# EAGLE design Brain_0.1.rv1 (EAGLE 9.6.2)
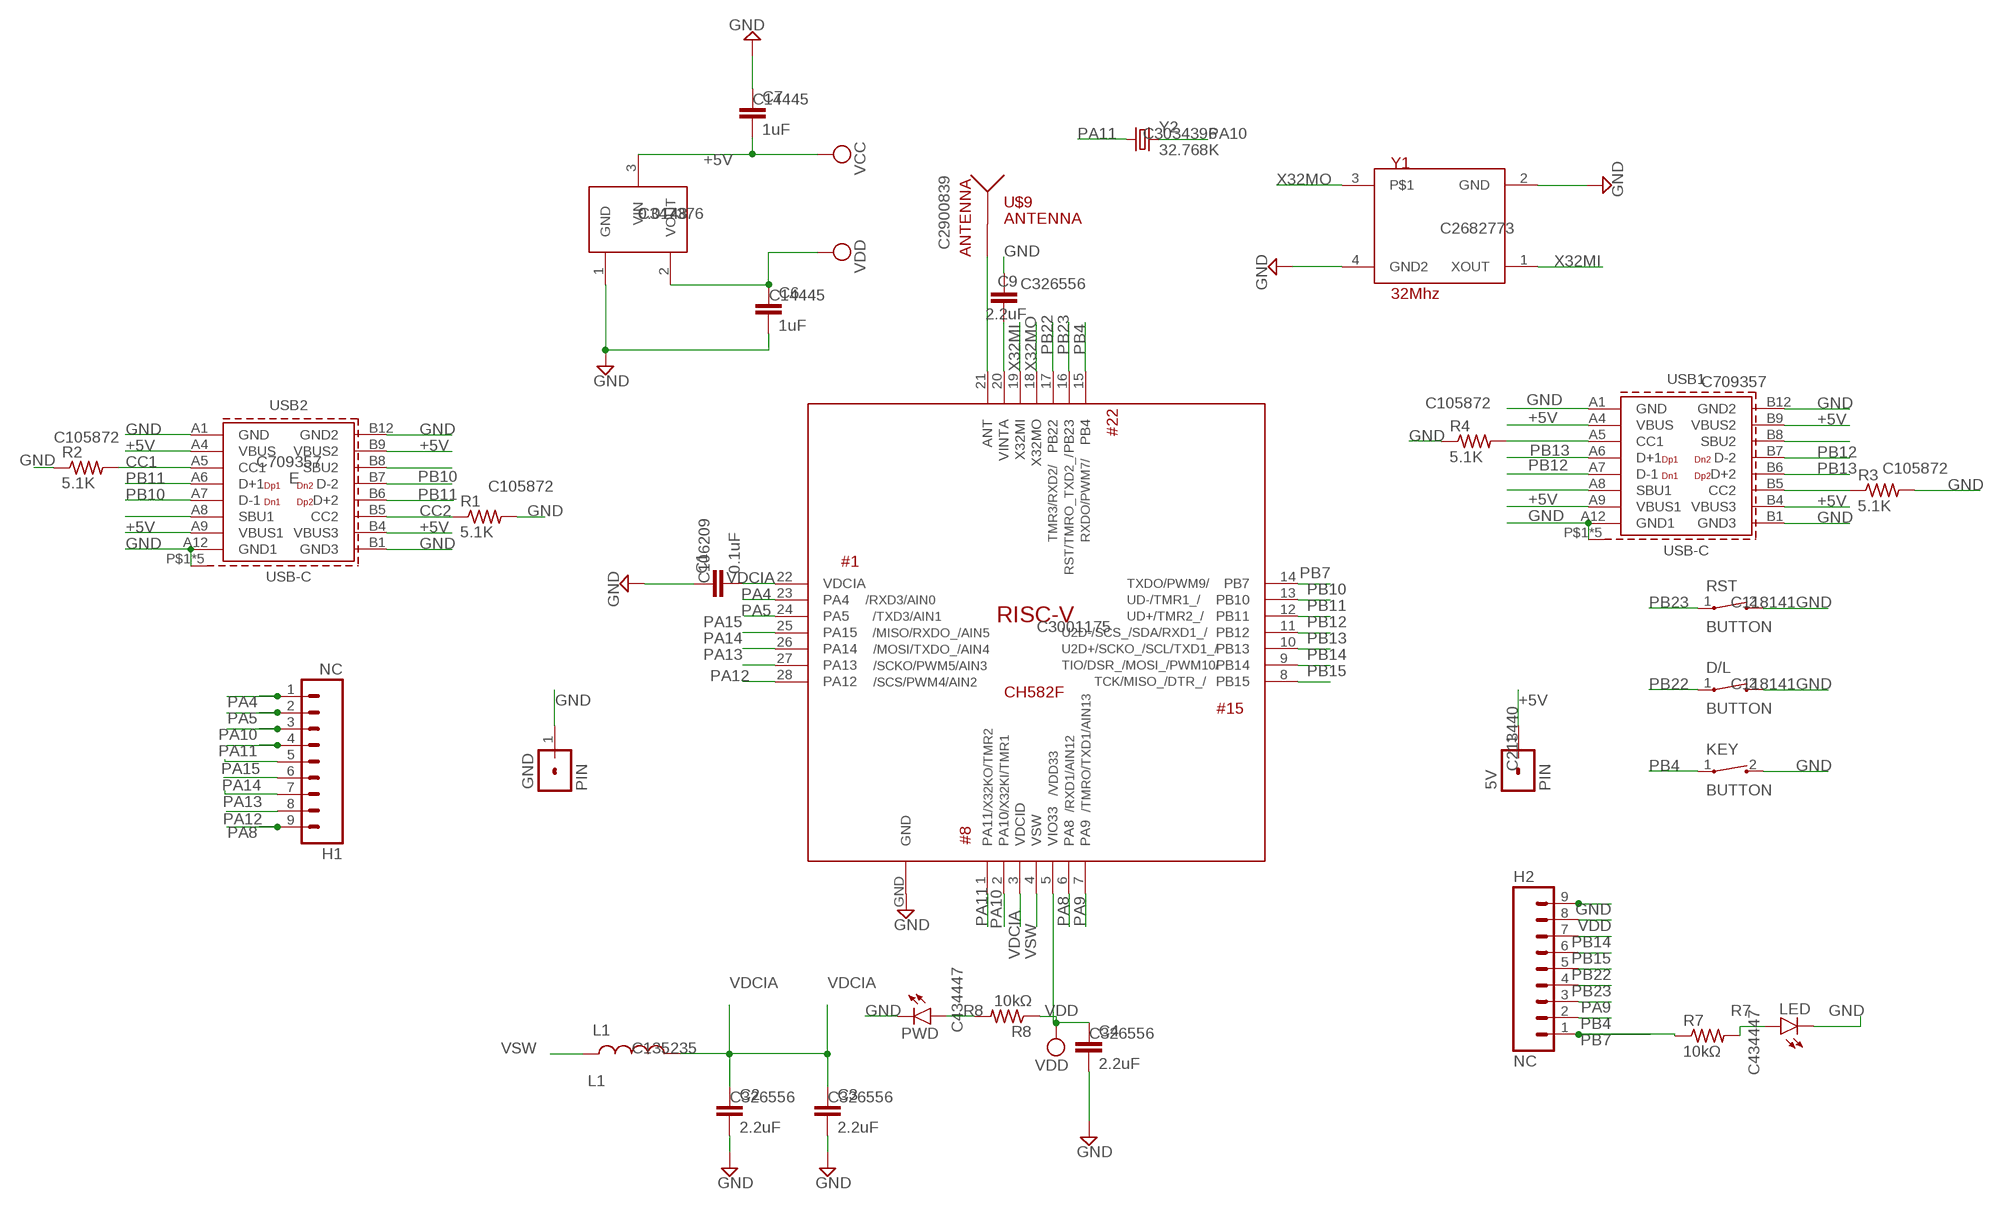
[diagram p0: schematic, sheet 1]

## Parts
5V  PIN  [1X01]
C1  0.1uF  C  [C1]
C2  2.2uF  C  [C1]
C3  2.2uF  C  [C1]
C4  2.2uF  C  [C1]
C6  1uF  C  [C1]
C7  1uF  C  [C1]
C9  2.2uF  C  [C1]
D/L  BUTTON  [SOD8037X250N]
GND  PIN  [1X01]
H1  NC  H  [61300911821]
H2  NC  H  [61300911821]
KEY  BUTTON  [SOD8037X250N]
L1  L1  [RESC3025X120N]
LED  LED  [CAPCP1005X40N]
PWD  LED  [CAPCP1005X40N]
R1  5.1K  RR0402  [R0402]
R2  5.1K  RR0402  [R0402]
R3  5.1K  RR0402  [R0402]
R4  5.1K  RR0402  [R0402]
R7  10kΩ  RR0402  [R0402]
R8  10kΩ  RR0402  [R0402]
RST  BUTTON  [SOD8037X250N]
U1  U1  [SOT95P240X90-3N]
U$8  RISC-V  [QFN40P400X400X75-29T280N]
U$9  ANTENNA  [CAPCP3015X50N]
USB1  629722000214  J1  [629722000214]
USB2  629722000214  J1  [629722000214]
Y1  Y1YSX211SL  [OSCCC200X160X50N]
Y2  32.768K  Y2  [XTAL700X315X230N]

## Nets
+5V: 5V.1 C7.2 U1.3(VIN) USB1.A4(VBUS) USB1.A9(VBUS1) USB1.B4(VBUS3) USB1.B9(VBUS2) USB2.A4(VBUS) USB2.A9(VBUS1) USB2.B4(VBUS3) USB2.B9(VBUS2) ; supply symbol labelled VCC
CC1: R2.2 USB2.A5(CC1)
CC2: R1.1 USB2.B5(CC2)
GND: C1.1 C2.2 C3.2 C4.2 C6.2 C7.1 C9.1 D/L.2 GND.1 H2.9 KEY.2 LED.C PWD.C R1.2 R2.1 R3.2 R4.1 RST.2 U1.1(GND) U$8.GND USB1.A1(GND) USB1.A12(GND1) USB1.B1(GND3) USB1.B12(GND2) USB1.P$1(SHIELD) USB1.S1(SHIELD) USB1.S2(SHIELD) USB1.S3(SHIELD) USB1.S4(SHIELD) USB2.A1(GND) USB2.A12(GND1) USB2.B1(GND3) USB2.B12(GND2) USB2.P$1(SHIELD) USB2.S1(SHIELD) USB2.S2(SHIELD) USB2.S3(SHIELD) USB2.S4(SHIELD) Y1.2(GND) Y1.4(GND2)
N$1: U$8.21(ANT) U$9.1
N$2: C9.2 U$8.20(VINTA)
N$3: USB1.B8(SBU2)
N$4: R3.1 USB1.B5(CC2)
N$6: USB2.A8(SBU1)
N$11: USB2.B8(SBU2)
N$13: R4.2 USB1.A5(CC1)
N$16: USB1.A8(SBU1)
PA4: H1.1 U$8.23(PA4)
PA5: H1.2 U$8.24(PA5)
PA8: H1.9 U$8.6(PA8)
PA9: H2.3 U$8.7(PA9)
PA10: H1.3 U$8.2(PA10) Y2.2
PA11: H1.4 U$8.1(PA11) Y2.1
PA12: H1.8 U$8.28(PA12)
PA13: H1.7 U$8.27(PA13)
PA14: H1.6 U$8.26(PA14)
PA15: H1.5 U$8.25(PA15)
PB4: H2.2 KEY.1 U$8.15(PB4)
PB7: H2.1 R7.1 U$8.14(PB7)
PB10: U$8.13(PB10) USB2.A7(D-1) USB2.B7(D-2)
PB11: U$8.12(PB11) USB2.A6(D+1) USB2.B6(D+2)
PB12: U$8.11(PB12) USB1.A7(D-1) USB1.B7(D-2)
PB13: U$8.10(PB13) USB1.A6(D+1) USB1.B6(D+2)
PB14: H2.7 U$8.9(PB14)
PB15: H2.6 U$8.8(PB15)
PB22: D/L.1 H2.5 U$8.17(PB22)
PB23: H2.4 RST.1 U$8.16(PB23)
R7: LED.A R7.2
R8: PWD.A R8.2
VDCIA: C1.2 C2.1 C3.1 L1.2 U$8.3(VDCID) U$8.22(VDCIA)
VDD: C4.1 C6.1 H2.8 R8.1 U1.2(VOUT) U$8.5(VIO33)
VSW: L1.1 U$8.4(VSW)
X32MI: U$8.19(X32MI) Y1.1(XOUT)
X32MO: U$8.18(X32MO) Y1.3
Unconnected: U$9.2

## Library data of the parts
5V GND = CH582M:PIN; LCSC: C213440
C1 = CH582M:C: CAPACITOR naming: grid - package width; LCSC: C106209; PRICE-1: 0.0014; PRICE-100: 0.0014; PRICE-1000: 0.0011
C2-C4 = CH582M:C: CAPACITOR naming: grid - package width; LCSC: C326556; PRICE-1: 0.0176; PRICE-100: 0.0176; PRICE-1000: 0.0148
C6 C7 = CH582M:C: CAPACITOR naming: grid - package width; LCSC: C14445; PRICE-1: 0.0018; PRICE-100: 0.0018; PRICE-1000: 0.0014
C9 = CH582M:C: CAPACITOR naming: grid - package width; LCSC: C326556; PRICE-1: 0.0167; PRICE-100: 0.0167; PRICE-1000: 0.0136
D/L KEY RST = CH582M:BUTTON; LCSC: C118141; PRICE-1: 0.069; PRICE-100: 0.0575; PRICE-1000: 0.0475
H1 H2 = CH582M:H
L1 = CH582M:L1; LCSC: C135235; PRICE-1: 0.0590; PRICE-100: 0.0487; PRICE-1000: 0.0358
LED PWD = CH582M:LED: LED OSRAM: - CHIPLED LG R971, LG N971, LY N971, LG Q971, LY Q971, LO R971, LY R971 LH N974, LH R974 LS Q976, LO Q976, LY Q976 LO Q996 - Hyper CHIPLED LW Q18S LB Q993, LB Q99A, LB R99A - SideLED LS A670, LO A670, LY A670, LG A670, LP A670 LB A673, LV A673, LT A673, LW A673 LH A674 LY A675 LS A676, LA A676, LO A676, LY A676, LW A676 LS A679, LY A679, LG A679 - Hyper Micro SIDELED® LS Y876, LA Y876, LO Y876, LY Y876 LT Y87S - SmartLED LW L88C, LW L88S LB L89C, LB L89S, LG L890 LS L89K, LO L89K, LY L89K LS L896, LA L896, LO L896, LY L896 - TOPLED LS T670, LO T670, LY T670, LG T670, LP T670 LSG T670, LSP T670, LSY T670, LOP T670, LYG T670 LG T671, LOG T671, LSG T671 LB T673, LV T673, LT T673, LW T673 LH T674 LS T676, LA T676, LO T676, LY T676, LB T676, LH T676, LSB T676, LW T676 LB T67C, LV T67C, LT T67C, LS T67K, LO T67K, LY T67K, LW E67C LS E67B, LA E67B, LO E67B, LY E67B, LB E67C, LV E67C, LT E67C LW T67C LS T679, LY T679, LG T679 LS T770, LO T770, LY T770, LG T770, LP T770 LB T773, LV T773, LT T773, LW T773 LH T774 LS E675, LA E675, LY E675, LS T675 LS T776, LA T776, LO T776, LY T776, LB T776 LHGB T686 LT T68C, LB T68C - Hyper Mini TOPLED® LB M676 - Mini TOPLED Santana® LG M470 LS M47K, LO M47K, LY M47K Source: http://www.osram.convergy.de LUXEON: - LUMILED® LXK2-PW12-R00, LXK2-PW12-S00, LXK2-PW14-U00, LXK2-PW14-V00 LXK2-PM12-R00, LXK2-PM12-S00, LXK2-PM14-U00 LXK2-PE12-Q00, LXK2-PE12-R00, LXK2-PE12-S00, LXK2-PE14-T00, LXK2-PE14-U00 LXK2-PB12-K00, LXK2-PB12-L00, LXK2-PB12-M00, LXK2-PB14-N00, LXK2-PB14-P00, LXK2-PB14-Q00 LXK2-PR12-L00, LXK2-PR12-M00, LXK2-PR14-Q00, LXK2-PR14-R00 LXK2-PD12-Q00, LXK2-PD12-R00, LXK2-PD12-S00 LXK2-PH12-R00, LXK2-PH12-S00 LXK2-PL12-P00, LXK2-PL12-Q00, LXK2-PL12-R00 Source: www.luxeon.com KINGBRIGHT: KA-3528ASYC Source: www.kingbright.com; LCSC: C434447; PRICE-1: 0.0140; PRICE-100: 0.0140; PRICE-1000: 0.0111
R1-R4 = CH582M:R: RESISTOR, American symbol; LCSC: C105872; PRICE-1: 0.0006; PRICE-100: 0.0006; PRICE-1000: 0.0005; SPICEPREFIX: R
R7 = CH582M:R: RESISTOR, American symbol; LCSC: C25744; PRICE-1: 0.0006; PRICE-100: 0.0006; PRICE-1000: 0.0004; SPICEPREFIX: R
R8 = CH582M:R: RESISTOR, American symbol; LCSC: C25744; LCSC_PART: C25744; PRICE-1: 0.0006; PRICE-100: 0.0006; PRICE-1000: 0.0004; SPICEPREFIX: R
U1 = CH582M:U1; LCSC: C347376; PRICE-1: 0.0219; PRICE-100: 0.0219; PRICE-1000: 0.0148
U$8 = CH582M:RISC-V: Model: CH582F Documentation: Datasheet <https://github.com/claudioolmedo/risc-v/blob/main/CH582F/documentation/CH582F-CH583DS1-datasheet.pdf> Desing by: claudioolmedo.com <https://claudioolmedo.com/contribute-at-scanfcode/>; LCSC: C3001175; PRICE-1: 1.031; PRICE-100: 0.6794; PRICE-1000: 0.6141
U$9 = CH582M:ANTENNA; LCSC: C2900839; PRICE-1: 0.0577; PRICE-100: 0.046; PRICE-1000: 0.0402
USB1 = CH582M:J1: USB-C Female; APPLICATION: USB 2.0; DATASHEET-URL: https://www.we-online.com/redexpert/spec/629722000214?ae; GERDER: Receptacle; INTERFACE-TYPE: Type C; IR: 5A; LCSC: C709357; MOUNT: SMT; PACKAGING: Tape and Reel; PART-NUMBER: 629722000214; PINS: 16; PRICE-1: 0.0767; PRICE-100: 0.062; PRICE-1000: 0.0446; TYPE: Horizontal; WORKING-VOLTAGE: 20V(AC)
USB2 = CH582M:J1: USB-C Female; APPLICATION: USB 2.0; DATASHEET-URL: https://www.we-online.com/redexpert/spec/629722000214?ae; E: 1; GERDER: Receptacle; INTERFACE-TYPE: Type C; IR: 5A; LCSC: C709357; MOUNT: SMT; PACKAGING: Tape and Reel; PART-NUMBER: 629722000214; PINS: 16; PRICE-1: 0.0767; PRICE-100: 0.062; PRICE-1000: 0.0446; TYPE: Horizontal; WORKING-VOLTAGE: 20V(AC)
Y1 = CH582M:Y1; LCSC: C2682773; PRICE-1: 0.1077; PRICE-100: 0.0871; PRICE-1000: 0.069
Y2 = CH582M:Y2; LCSC: C3034396; PRICE-1: 0.1254; PRICE-100: 0.1013; PRICE-1000: 0.0802

## Board
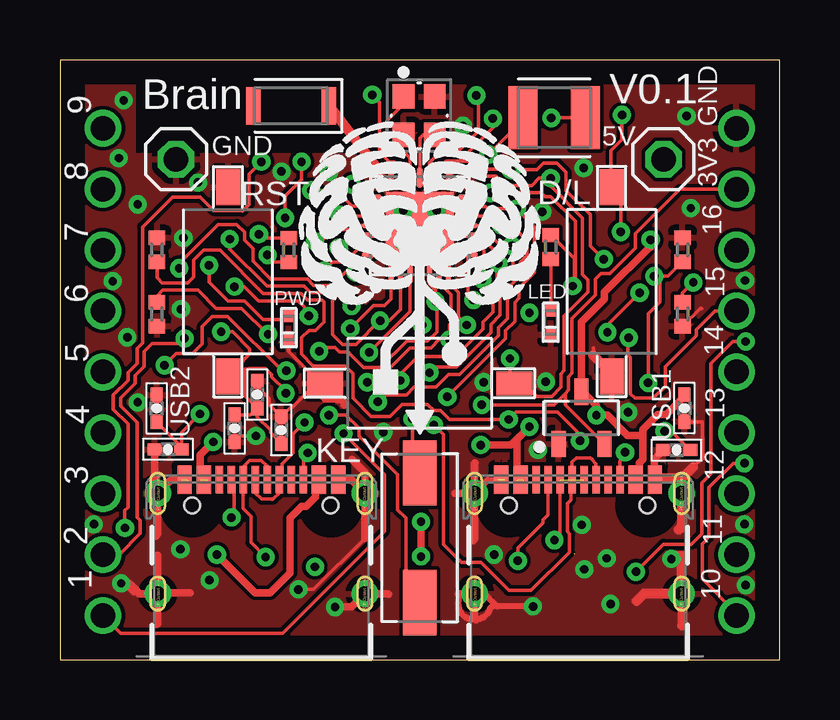
[diagram p1: board, top side]
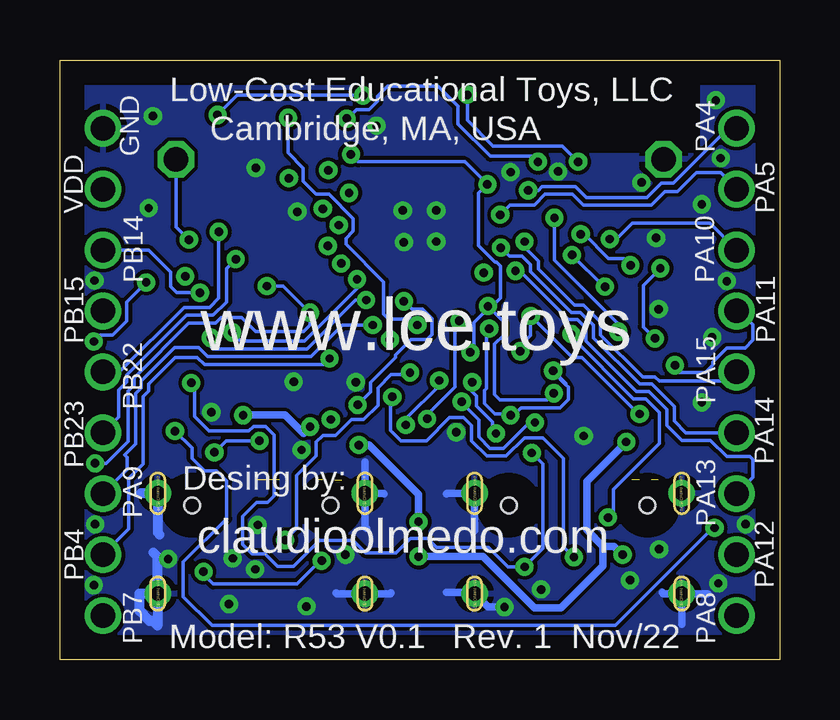
[diagram p2: board, bottom side, seen from below]

Size 30 x 25 mm. Coordinates in mm from the lower left corner, seen from the top.
Outline: 0,0 30,0 30,25 0,25 0,0
Copper layers (1*16): Top 0.035mm / dielectric 0.15mm / Bottom 0.035mm
Design rules "default *": minimum track width 6mil, minimum drill 0.35mm, track to track 6mil, track to pad 6mil, pad to pad 6mil, via to via 6mil, smd to smd 6mil, copper to edge 40mil, drill to drill 6mil, minimum pad ring 10mil, minimum via ring 8mil, stop-mask expansion 4mil, vias tented up to drill 15mil, thermal gap 10mil

### Footprints (pad centres in the part's own frame; a part is rotated, then mirrored left to right if it is on the bottom)
1X01 = drill 1.016 octagon: 1 0,0
C1 = smd 0.61 x 0.508: 1 -0.559,0; 2 0.559,0
SOD8037X250N = smd 1.5 x 1: 1 -3.95,0; 2 3.95,0
61300911821 = drill 1.02: 1 -10.16,0; 2 -7.62,0; 3 -5.08,0; 4 -2.54,0; 5 0,0; 6 2.54,0; 7 5.08,0; 8 7.62,0; 9 10.16,0
RESC3025X120N = smd 1.212 x 2.612: 1 -1.3,0; 2 1.3,0
CAPCP1005X40N = smd 0.512 x 0.612: A -0.5,0; C 0.5,0
R0402 = smd 0.6 x 0.7: 1 -0.5,0; 2 0.5,0
SOT95P240X90-3N = smd 1.096 x 0.589: 1 -1.087,0.95; 2 -1.087,-0.95; 3 1.087,0
QFN40P400X400X75-29T280N = smd 0.838 x 0.22: 1 -2,1.2; 2 -2,0.8; 3 -2,0.4; 4 -2,0; 5 -2,-0.4; 6 -2,-0.8; 7 -2,-1.2; 15 2,-1.2; 16 2,-0.8; 17 2,-0.4; 18 2,0; 19 2,0.4; 20 2,0.8; 21 2,1.2 | smd 0.22 x 0.838: 8 -1.2,-2; 9 -0.8,-2; 10 -0.4,-2; 11 0,-2; 12 0.4,-2; 13 0.8,-2; 14 1.2,-2; 22 1.2,2; 23 0.8,2; 24 0.4,2; 25 0,2; 26 -0.4,2; 27 -0.8,2; 28 -1.2,2 | smd 2.8 x 2.8: GND 0,0
CAPCP3015X50N = smd 0.61 x 1.56: 1 -1.575,0; 2 1.575,0
629722000214 = smd 0.3 x 1.15: A1 -3.35,4.745; A4 -2.55,4.745; A5 -1.25,4.745; A6 -0.25,4.745; A7 0.25,4.745; A8 1.25,4.745; A9 2.55,4.745; A12 3.35,4.745; B1 3.05,4.745; B4 2.25,4.745; B5 1.75,4.745; B6 0.75,4.745; B7 -0.75,4.745; B8 -1.75,4.745; B9 -2.25,4.745; B12 -3.05,4.745 | drill 0.6: P$1 -4.32,0 | drill 0.6 pad 1: S1 -4.32,4.18; S2 4.32,4.18; S3 -4.32,0; S4 4.32,0 | hole 0.65: -2.89,3.68; 2.89,3.68
OSCCC200X160X50N = smd 1.012 x 0.912: 1 -0.8,-0.65; 2 0.8,-0.65; 3 0.8,0.65; 4 -0.8,0.65
XTAL700X315X230N = smd 2.712 x 1.412: 1 -2.7,0; 2 2.7,0

### Placement (x,y rotation side)
5V  25.16,20.86 0 top
C1  8.23,11.05 270 top
C2  7.28,9.64 270 top
C3  9.23,9.57 90 top
C4  4.51,8.77 180 top
C6  4.03,10.47 90 top
C7  26.03,10.48 90 top
C9  25.71,8.73 0 top
D/L  23,15.75 270 top
GND  4.84,20.86 0 top
H1  1.79,11.99 270 top
H2  28.21,11.99 90 top
KEY  15,11.52 180 top
L1  20.61,22.59 180 top
LED  20.46,14.05 270 top
PWD  9.54,13.82 270 top
R1  25.96,17.08 90 top
R2  4.04,14.4 90 top
R3  4.04,17.08 90 top
R4  25.96,14.4 90 top
R7  20.46,17.2 270 top
R8  9.54,17.07 90 top
RST  7,15.75 90 top
U1  21.74,10.07 90 top
U$8  15,18.09 90 top
U$9  9.63,23.09 180 top
USB1  21.6,2.75 0 top
USB2  8.4,2.75 0 top
Y1  14.97,22.68 270 top
Y2  15,5.08 90 top

### Tracks (layer width: path | path; a pad name or v marks a point on that pad's centre or on a via)
+5V  (via drill 0.35)  (2 unrouted)
  Top 0.152: USB2.B4 USB2.A9 | USB1.B4 USB1.A9 | 24.22,9.35 24.3,9.35 24.31,9.34
  Top 0.305: USB1.B9 19.05,7.8 19.05,9.18 v19.57,9.71 18.81,8.94 v17.54,8.94 | 24.31,9.34 24.31,9.59 24.93,10.21 25.28,10.21 26.03,10.96 C7.2 | USB1.A9 24.15,8.19 24.3,8.33 24.3,9.27 24.22,9.35 23.66,9.35 22.82,10.19 v22.37,10.19 22.37,10.59 21.79,11.16 U1.3 21.73,11.17 21.73,14.07 22.7,15.04 22.7,15.32 24.63,17.25 v24.63,17.5 24.63,17.2 | USB2.A4 5.85,8.53 v6.39,9.07 | v15.05,5.74 v15.05,4.3 | USB2.B4 10.65,6.77 10.25,6.38 10.07,6.38 9.59,5.9 9.59,3.61 8.75,2.77 8.14,2.77 v6.54,4.37
  Bottom 0.152: v24.63,17.5 25.16,18.04 5V.1
  Bottom 0.305: v19.57,9.71 19.85,9.43 20.61,10.19 v22.37,10.19 | 7.36,4.73 7.36,3.91 9.11,2.16 10.22,2.16 12.36,4.3 v15.05,4.3 | 7.36,4.73 8.04,5.41 8.04,7.42 v6.39,9.07 | v15.05,5.74 15.05,6.89 17.11,8.94 v17.54,8.94 | 7.36,4.73 6.9,4.73 v6.54,4.37
CC1  (via drill 0.35)
  Top 0.152: USB2.A5 7.27,7.37 7.27,6.04 v7.15,5.92 | R2.2 4.04,15.16 4.28,15.4 5.75,15.4 6.52,14.63 7.58,14.63 8.65,13.57 v8.68,13.57
  Bottom 0.152: v7.15,5.92 6.92,6.15 6.92,7.09 5.01,9.01 5.01,10.3 5.58,10.87 6.09,10.87 8.68,13.46 v8.68,13.57
CC2  (via drill 0.35)  (1 unrouted)
  Top 0.152: R1.1 25.35,15.98 v24.78,15.98 25.01,15.75 25.01,14.91 24.52,14.43 v24.52,11.54 | USB2.B5 10.15,8.43 v10.33,8.61
  Bottom 0.152: 10.68,3.91 v10.63,3.86 | 21.45,4.4 21.99,4.4 22.39,4.8 22.39,5.97 21.8,6.55 21.35,6.55 21.07,6.83 21.07,9.37 21.43,9.73 21.93,9.73 22.13,9.53 23.79,9.53 24.39,10.14 24.39,11.4 v24.52,11.54 | v10.33,8.61 9.87,8.16 9.87,4.63 v10.63,3.86 | v10.63,3.86 11.32,3.86 12.13,4.68 14.29,4.68 14.67,5.05 15.38,5.05 15.98,4.45 17.26,4.45 17.79,4.98 19.17,4.98 20.26,3.89 20.92,3.89 21.42,4.39
GND  (via drill 0.35)  (2 unrouted)
  Top 0.152: v19.72,2.21 18.23,2.21 18.15,2.29 18.01,2.29 17.88,2.16 17.87,2.13 17.87,2.11 17.85,2.08 17.84,2.04 17.82,2.04 17.8,2 17.8,1.97 17.66,1.83 17.63,1.83 17.6,1.81 17.59,1.8 17.56,1.79 17.52,1.77 17.51,1.77 17.47,1.76 17.46,1.74 17.42,1.74 17.39,1.73 17.37,1.73 17.33,1.73 17.32,1.72 17.24,1.72 17.23,1.73 17.2,1.73 17.18,1.73 17.14,1.74 17.11,1.74 17.1,1.76 17.06,1.77 17.04,1.77 17.01,1.79 16.98,1.8 16.97,1.81 16.94,1.83 16.91,1.83 16.77,1.97 16.77,2 16.75,2.04 16.73,2.04 16.72,2.08 16.7,2.11 16.7,2.13 16.69,2.16 16.68,2.17 16.67,2.21 16.66,2.25 16.67,2.26 16.66,2.29 16.66,2.3 16.66,2.34 16.65,2.39 16.66,2.39 16.66,2.75 | 11.82,7.5 USB2.A12 USB2.B1 | v2.55,3.18 2.63,3.18 | 2.63,3.18 2.88,3.18 3.02,3.18 3.45,2.75 | USB2.S3 3.06,2.75 2.63,3.18 | USB2.S1 3.95,7.05 | v9.95,2.92 10.58,2.92 12.72,5.06 | D/L.2 22.88,11.92 22.88,12.04 | 22.24,12.98 22.24,12.68 | C7.1 26.04,9.91 26.79,9.91 26.79,9.25 26.8,9.23 26.8,8.38 26.66,8.25 26.63,8.25 26.41,8.03 | C1.1 8.23,11.37 8.71,10.89 8.71,10.64 C3.2 9.59,10.5 9.66,10.5 10.55,11.38 10.69,11.52 KEY.2 10.63,11.94 10.43,11.94 9.54,12.84 PWD.C | C2.2 7.53,9.32 v8.17,9.32 | R4.1 26.69,14.63 26.76,14.63 | USB1.B1 USB1.A12
  Top 0.254: USB1.S1 17.85,7.5 USB1.A1 | USB1.S3 17.69,2.75 18.23,2.21 | 16.61,2.75 16.61,2.41 16.6,2.4 16.61,2.34 16.61,2.28 16.61,2.27 16.61,2.25 16.62,2.2 16.62,2.04 16.91,1.76 16.94,1.76 16.99,1.74 17.04,1.69 17.13,1.69 17.18,1.67 17.2,1.68 17.21,1.68 17.23,1.67 17.34,1.67 17.35,1.68 17.36,1.68 17.38,1.67 17.43,1.69 17.53,1.69 17.58,1.74 17.63,1.76 17.66,1.76 17.88,1.97 17.88,2.01 17.89,2.06 17.92,2.1 17.92,2.12 17.92,2.13 17.93,2.13 18.01,2.21 v19.72,2.21
  Top 0.305: USB1.B1 24.78,7.62 24.78,8.36 C9.1 | 11.82,7.5 12.15,7.5 USB2.S2 | USB2.A1 4.64,7.5 USB2.S1 4.08,5.23 4,5.16 | 3.95,7.05 C4.2 | USB2.S2 12.72,5.06 | 13.71,2.72 13.68,2.75 USB2.S4 12.15,2.19 v11.47,2.19 | USB2.S2 | USB1.S1 17.28,5.03 17.21,4.96 | USB2.S3 3.31,2.75 2.88,3.18 | USB2.S3 4.1,2.77 5.42,2.77 | USB2.S3 4.08,4.35 | USB2.S3 4.08,1.5 4.05,1.48 | USB1.S1 16.48,6.93 16.47,6.94 | USB1.S1 17.28,8.18 17.31,8.21 | 16.61,2.75 USB1.S3 17.28,1.72 17.34,1.67 | USB2.S2 12.72,7.8 12.18,8.33 | KEY.2 11.73,10.84 | 11.73,10.84 11.85,10.72 11.85,10.62 | 11.73,10.84 11.54,10.84 11.5,10.87 11.07,10.87 10.55,11.38
  Top 0.406: 22.24,12.68 22.88,12.04 | 25.92,7.55 USB1.S2 25.92,5.54 25.8,5.41 | 26.41,8.03 25.92,7.55 | 25.92,7.55 25.01,7.55 USB1.A12 | USB1.S4 25.92,4.17 26.05,4.3 25.59,4.3 v25.49,4.19 | USB1.S4 24.35,2.75 24.04,2.44 | USB1.S4 25.95,2.73 25.95,1.43
  Bottom 0.152: 12.72,5.37 12.69,5.34
  Bottom 0.305: 13.88,6.91 13.86,6.93 USB2.S2 12.72,5.37 | 13.88,2.8 12.76,2.8 USB2.S4 12.15,2.19 v11.47,2.19 | 16.19,2.77 16.22,2.75 USB1.S3 18.46,2.75 18.48,2.77 | USB2.S3 2.99,2.75 | USB2.S3 4.08,1.48 | USB2.S3 4.84,2.75 4.89,2.8 | USB1.S1 16.52,6.93 16.5,6.91 | USB1.S1 17.28,5.54 17.21,5.46 | USB1.S1 17.28,8.23 17.29,8.23
  Bottom 0.406: USB1.S4 25.92,1.45 25.95,1.43 26.14,1.61 26.27,1.61 26.69,2.03 26.69,2.41 26.69,2.43 26.68,2.44 26.68,2.75 | 26.68,2.75 | USB1.S4 25.92,4.27 26.1,4.45 | USB1.S4 26.67,2.75 26.68,2.75 | 25.85,5.21 25.92,5.29 USB1.S2 26.63,6.93 26.63,6.94
  other vias: 14.31,18.72 14.31,17.43 13.48,9.48 22.8,4.22 6.24,3.31 5.14,17.58 20.26,11.59 28.56,15.8 28.54,5.64 28.59,3.1 3.24,18.98 21.83,20.5 20.11,18.67 15.71,18.72 15.66,17.4 26.3,18.82 11.22,20.32 5.75,19.89 21.76,5.62 19.93,8.74 21.86,3.76 18.1,4.37 26.13,22.66 3.24,10.72 5.02,4.6 2.2,15.78 5.04,14.61 17.67,11.56 2.45,20.91 2.66,23.32 1.41,5.64 22.95,2.31 2.81,13.44 23.69,10.32 16.8,22.25 9.23,20.35
  pour Top: -0.6,25.2 3.1,25.2 3.1,21.05 12.23,21.05 12.23,25.89 30.8,25.7 30.8,-0.5 30.3,-1 -0.3,-1 -1.2,-0.1 -1.2,24.6
  pour Bottom: 12.15,25.4 30.6,25.4 30.6,-1 0.4,-1 -0.7,0.1 -0.7,24.9 0.1,25.7 3.1,25.7 3.25,25.55 3.25,21.06 12.15,21.06
N$1
  Top 0.2: 13.35,20.35 arc90 13.61,20.09 U$8.21
  Top 0.406: U$9.1 11.31,22.98 13.35,20.35
N$2  (via drill 0.35)
  Top 0.152: U$8.20 14.19,20.1 14.19,20.49 13.94,20.74 13.75,20.74 13.32,21.16 13.32,23.24 v13.02,23.55 | v2.71,5.49 2.71,6.23 2.83,6.35 2.83,9.82 2.23,10.42 2.23,11.02 2.83,11.63 2.83,11.97 3.21,12.35 3.21,12.98 3.44,13.21 3.44,18.03 4.69,19.29 5.85,19.29 6.4,18.73 7.59,18.73 7.61,18.7 7.89,18.97 7.89,20.25 v8.4,20.76 | v25.21,9.53 25.47,9.53 C9.2
  Bottom 0.152: v2.71,5.49 2.78,5.49 6.85,1.43 23.66,1.43 24.86,2.62 24.86,4.06 23.05,5.87 23.05,7.45 23.46,7.86 23.96,7.86 24.5,8.39 24.5,8.81 v25.21,9.53 | v8.4,20.76 9.06,21.41 11.95,21.41 13.02,22.48 v13.02,23.55
N$4  (via drill 0.35)
  Top 0.152: R3.1 4.04,15.92 4.26,15.7 5.32,15.7 5.58,15.95 5.58,16.67 5.99,17.07 6.67,17.07 8.48,15.26 10.06,15.26 10.33,14.99 10.94,14.99 11.02,14.91 11.02,14.07 10.66,13.72 10.38,13.72 10.07,13.42 10.07,12.73 10.56,12.25 11.89,12.25 12.21,11.93 12.21,10.9 12.97,10.14 13.52,10.14 13.53,10.14 13.75,10.14 14.26,10.64 15.33,10.64 15.59,10.39 15.87,10.39 16.25,10.01 v18.71,10.01 19.01,10.32 20.74,10.32 21.68,9.38 v21.68,9.12 | 23.35,7.29 USB1.B5 23.35,8.28 23.56,8.49 v23.56,8.64
  Bottom 0.152: v21.68,9.12 23.08,9.12 v23.56,8.64
N$13  (via drill 0.35)
  Top 0.152: USB1.A5 20.35,6.04 20.13,5.82 20.13,5.7 19.09,4.65 v19.09,4.12 | v24.02,3.66 25.16,4.8 26.33,4.8 26.76,5.23 26.76,7.36 27.14,7.75 27.14,10.21 27.14,12.35 28.05,13.26 v28.59,13.26 | v26.41,15.73 25.96,15.28 R4.2
  Bottom 0.152: v19.09,4.12 19.15,4.12 20.11,3.15 23.61,3.15 24.02,3.56 v24.02,3.66 | v28.59,13.26 28.31,13.54 27.8,13.54 27.21,14.12 27.21,14.92 v26.41,15.73
PA4  (via drill 0.35)
  Top 0.152: U$8.23 12.99,18.9 12.17,18.9 11.51,19.56 v10.48,19.56
  Bottom 0.152: 10.4,19.64 v10.48,19.56 10.05,19.56 9.9,19.71 8.5,19.71 8.06,19.27 5.52,19.27 4.92,19.87 4.43,19.87 2.14,22.15 H1.1
PA5  (via drill 0.35)
  Top 0.152: v11.65,18.55 11.7,18.49 U$8.24
  Bottom 0.152: H1.2 1.79,19.64 2.45,20.3 3.47,20.3 4.26,19.51 4.79,19.51 5.35,18.95 8.17,18.95 8.63,19.41 9.77,19.41 10.23,18.95 11.24,18.95 v11.65,18.55
PA8  (via drill 0.35)
  Top 0.152: U$8.6 15.81,16.08 15.81,15.69 16.29,15.21 16.29,14.03 16.25,13.98 v16.25,13.34 15.81,13.34 15.46,12.98 14.59,12.98 13.35,11.74 | 13.35,11.74 13.29,11.69 | v11.82,9.43 13.53,7.72 13.53,5.34 9.28,1.09 2.53,1.09 H1.9 | v12.82,11.56 13,11.74 13.35,11.74
  Bottom 0.152: v11.82,9.43 11.98,9.58 11.98,9.91 12.64,10.58 12.64,11 12.82,11.17 v12.82,11.56
PA9  (via drill 0.35)
  Top 0.152: v16.96,13.95 16.62,14.28 16.62,15.31 16.2,15.73 U$8.7
  Bottom 0.152: v16.96,13.95 18.23,13.95 19.53,12.64 23.85,12.64 24.21,13.01 25.21,13.01 26.61,11.62 26.61,11.33 26.84,11.1 26.84,10.21 26.84,8.99 27.29,8.53 27.2,8.43 27.2,7.93 H2.3
PA10  (via drill 0.35)
  Top 0.152: U$8.2 14.19,16.08 14.19,14.59 13.73,14.13 v13.35,14.13 13.32,14.13 12.34,13.14 11.78,13.14 11.36,13.56 11.36,15.03 11.09,15.3 10.46,15.3 10.19,15.57 8.63,15.57 7.08,17.12 v7.08,17.53 | v14.7,10.04 14.7,8.13 Y2.2
  Bottom 0.152: H1.3 2.91,18.19 6.13,18.19 6.8,17.53 v7.08,17.53 | 14.72,10.06 v14.7,10.04 14.7,10.19 13.52,11.36 13.52,13.95 v13.35,14.13
PA11  (via drill 0.35)
  Top 0.152: v9.44,12.04 9.26,12.04 7,14.3 6.34,14.3 5.93,13.89 5.93,13.16 5.53,12.75 4.84,12.75 v4.36,12.27 | Y2.1 15.05,2.34 Y2.1 | Y2.1 15,3.29 | v11.21,10.19 11.23,10.2 11.91,10.2 12.46,9.65 12.46,9.33 14.07,7.72 14.07,6.25 14.42,5.9 14.42,2.97 Y2.1 | v12.1,13.79 13.07,14.76 13.53,14.76 13.8,15.03 U$8.1
  Bottom 0.152: v4.36,12.27 4.36,11.97 3.09,11.97 2.79,12.27 2.79,12.4 2.2,12.99 1.44,12.99 1.11,13.32 1.11,13.97 1.66,14.53 H1.4 | 8.9,11.45 8.9,11.51 v9.44,12.04 9.44,11.99 8.9,11.45 | 8.9,11.45 8.8,11.35 8.8,10.85 9.16,10.5 10.78,10.5 11.08,10.19 v11.21,10.19 11.27,10.24 11.87,10.24 12.31,10.68 12.31,11.21 12.21,11.31 12.21,13.69 v12.1,13.79
PA12  (via drill 0.35)
  Top 0.152: U$8.28 13,16.8 v12.33,16.13 11.9,16.13 11.37,15.6 10.58,15.6 10.31,15.87 8.78,15.87 8.04,16.61 8.04,17.12 7.69,17.48 7.69,17.83 7.38,18.14 6.6,18.14 4.97,16.51 v4.97,16.31 | H1.8 2.46,4.37 3.34,5.25 3.34,5.79 3.21,5.92 3.21,9.89 2.53,10.57 2.53,10.9 3.14,11.5 3.14,11.84 3.52,12.22 3.52,12.85 3.85,13.18 4.99,13.18 v5.2,13.39
  Bottom 0.152: 5.09,13.49 v5.2,13.39 5.68,13.87 5.68,15.6 v4.97,16.31
PA13  (via drill 0.35)
  Top 0.152: v11.01,16.21 11.37,16.57 11.87,16.57 12.6,17.29 U$8.27
  Bottom 0.152: 1.79,7.55 H1.7 1.11,7.6 1.11,8.33 1.23,8.46 2.2,8.46 2.88,9.13 4.06,9.13 4.7,9.77 4.7,10.43 5.45,11.18 5.96,11.18 8.07,13.29 8.07,13.82 8.42,14.17 8.8,14.17 10.83,16.21 v11.01,16.21
PA14  (via drill 0.35)
  Top 0.152: v11.62,17.17 11.95,17.5 12.13,17.5 12.31,17.69 U$8.26
  Bottom 0.152: v11.62,17.17 11.26,16.82 10.73,16.82 10.38,16.46 10.38,16.18 8.67,14.48 8.3,14.48 7.76,13.94 7.76,13.41 5.83,11.48 5.32,11.48 4.39,10.56 4.39,9.95 3.9,9.45 H1.6
PA15  (via drill 0.35)
  Top 0.152: U$8.25 12.24,18.09 12.07,17.93 11.38,17.93 10.88,17.43 v10.63,17.43
  Bottom 0.152: H1.5 2.17,11.61 5.02,11.61 5.2,11.79 5.71,11.79 7.46,13.54 7.46,14.07 8.17,14.78 8.55,14.78 10.05,16.28 10.05,16.62 10.63,17.2 v10.63,17.43
PB4  (via drill 0.35)
  Top 0.152: v18.76,12.55 18.76,11.71 KEY.1 19.33,11.52 19.88,10.98 20.51,10.98 20.89,11.36 20.89,11.91 21.02,12.04 21.02,14.33 22.01,15.32 22.01,15.82 21.79,16.05 21.79,18.41 20.46,19.74 v20.46,20.07 19.97,20.07 19.67,19.77 18.56,19.77 18.18,20.15 17.49,20.15 17.16,20.48 16.59,20.48 U$8.15
  Bottom 0.152: H2.2 27.14,5.44 27.14,7.55 26.53,8.17 26.53,10.97 26.3,11.2 26.3,11.49 25.19,12.6 24.27,12.6 23.97,12.3 19.01,12.3 v18.76,12.55
PB7  (via drill 0.35)
  Top 0.152: U$8.14 17.78,19.29 v17.95,19.46 | v17.95,19.46 18.1,19.31 | 21.44,15.64 21.48,15.68 21.48,18.29 20.46,19.31 20.21,19.31 20.06,19.46 v17.95,19.46 | 21.44,15.64 v21.38,15.57 | v28.54,8.18 28.07,8.18 27.06,7.17 27.06,5.11 26.79,4.83 26.79,3.36 28.21,1.93 H2.1 | R7.1 21.44,16.72 21.44,15.64
  Bottom 0.152: v28.54,8.18 28.07,8.18 27.16,9.09 27.16,11.2 26.91,11.45 26.91,11.74 24.63,14.02 23.51,14.02 23.28,14.25 22.42,14.25 21.84,13.67 19.85,13.67 19.57,13.95 v19.57,14.46 20.69,15.57 v21.38,15.57
PB10  (via drill 0.35)
  Top 0.152: U$8.13 17.73,18.89 17.82,18.8 v19.04,18.8 19.78,18.06 19.78,16.14 19.14,15.49 19.14,15.07 18.96,14.89 18.96,14.1 18.58,13.72 18.58,13.39 v16.14,10.95 | 8.65,7.3 USB2.A7 8.63,7.51 8.63,8.06 8.39,8.3 7.9,8.3 7.64,8.04 USB2.B7 7.64,6.29 7.96,5.97 7.96,4.88 v8.57,4.27 | v16.14,10.95
  Bottom 0.152: v8.57,4.27 9.01,4.71 9.01,8.38 9.87,9.25 10.63,9.25 11.4,8.48 12.2,8.48 12.84,9.12 12.84,9.75 13.17,10.08 13.76,10.08 14.72,9.12 15.79,9.12 16.22,9.56 16.22,10.87 v16.14,10.95
PB11  (via drill 0.35)
  Top 0.152: U$8.12 17.68,18.49 17.87,18.29 18.2,18.29 v18.38,18.11 18.84,18.11 19.48,17.47 19.48,16.85 19.19,16.56 19.19,15.99 18.83,15.63 18.83,15.2 18.66,15.02 18.66,14.23 18.28,13.85 18.28,13.52 16.65,11.89 16.2,11.89 15.67,11.36 14.77,11.36 14.44,11.03 13.53,11.03 v13.25,10.75 | v10.2,9.88 9.72,9.4 9.72,8.61 9.27,8.16 9.27,7.62 USB2.B6 9.15,6.95 8.89,6.69 8.86,6.69 8.85,6.68 8.84,6.69 8.4,6.69 8.14,6.95 USB2.A6 | v13.25,10.75 13.2,10.75 | 13.48,10.98 v13.25,10.75
  Bottom 0.152: v13.25,10.75 13.25,10.7 12.54,9.98 12.54,9.27 12.07,8.8 11.51,8.8 10.43,9.88 v10.2,9.88
PB12  (via drill 0.35)  (1 unrouted)
  Top 0.152: U$8.11 17.54,18.09 18.53,17.1 18.69,17.1 v18.84,17.25 18.89,17.2 18.89,16.26 18.88,16.26 18.88,16.11 18.53,15.75 18.53,15.32 18.35,15.15 18.35,14.36 17.97,13.97 17.97,13.64 16.53,12.2 15.64,12.2 v15.41,11.97 | v20.61,4.98 20.84,5.21 20.84,7.48 USB1.B7
  Bottom 0.152: v20.61,4.98 20.13,5.46 20.13,7.68 19.32,8.49 19.32,9.07 19.04,9.35 18.51,9.35 17.85,10.01 17.34,10.01 16.75,10.6 16.75,11.33 16.19,11.89 15.48,11.89 v15.41,11.97
PB13  (via drill 0.35)  (1 unrouted)
  Top 0.152: U$8.10 17.01,17.68 17.48,17.68 18.02,17.13 18.02,16.77 v18.28,16.51 18.22,16.46 18.22,15.45 18.05,15.27 18.05,14.48 17.64,14.07 17.64,13.77 16.5,12.63 14.92,12.63 14.19,11.89 v14.19,11.64 | v15.58,9.78 15.99,9.38 15.99,4.8 16.75,4.04 17.54,4.04 18.71,2.88 19.65,2.88 21.25,4.48 21.25,5.24 21.15,5.34 21.15,6.51 21.3,6.66 21.3,7.33 | USB1.A6 21.35,8.24 21.53,8.41 22.11,8.41 22.17,8.36 22.17,8.34 22.35,8.16 USB1.B6
  Bottom 0.152: v14.19,11.64 14.19,11.43 15.58,10.04 v15.58,9.78
PB14  (via drill 0.35)
  Top 0.152: U$8.9 17.43,17.29 17.67,17.05 17.67,15.91 v17.62,15.85 | v24.17,15.29 22.82,13.95 v22.82,13.64
  Bottom 0.152: v24.17,15.29 25.13,15.29 25.39,15.55 25.39,16.16 26.3,17.07 H2.7 | v22.82,13.64 22.47,13.29 19.8,13.29 17.62,15.47 v17.62,15.85
PB15  (via drill 0.35)
  Top 0.152: 17,16.79 U$8.8 17,15.15 17.16,14.99 v17.23,14.99 | v23.71,13.41 23.69,13.39 23.69,12.7 23.79,12.6 23.79,11.08 23.97,10.9 24.75,10.9 25.24,11.39 25.24,12.21 26.54,13.51 26.54,13.77 27.3,14.53 H2.6 | 28.21,14.11 H2.6 | H2.6 28.21,14.16 | 28.21,14.28 H2.6 | H2.6
  Bottom 0.152: v17.23,14.99 17.67,14.99 19.7,12.96 23.61,12.96 23.71,13.06 v23.71,13.41
PB22  (via drill 0.35)
  Top 0.152: U$8.17 15.41,20.72 15.81,21.12 16.53,21.12 17.44,22.02 17.44,23.45 v17.36,23.52 | v23.43,22.71 23.43,21.67 22.98,21.21 22.98,19.73 D/L.1 23.38,19.32 v23.38,17.83
  Bottom 0.152: v23.43,22.71 22.62,23.52 v17.36,23.52 | v23.38,17.83 23.38,15.06 23.76,14.68 24.83,14.68 27.52,11.99 H2.5
PB23  (via drill 0.35)
  Top 0.152: U$8.16 15.81,20.1 15.81,20.49 16.1,20.78 16.65,20.78 | 16.65,20.78 17.29,20.78 17.62,20.45 18.76,20.45 v18.81,20.4 18.84,20.43 19.88,20.43 20.16,20.7 20.71,20.7 21.1,20.32 21.1,19.56 22.11,18.54 22.11,17.25 v22.67,16.69 | 9.39,18.88 v9.39,18.42 9.39,19.33 10.07,20.01 v10.07,20.76 | v18.05,22.56 18.05,22.18 16.65,20.78 | v6.72,13.67 7.2,13.67 7.91,12.96 7.91,12.73 7.42,12.24 7.42,12.23 RST.1
  Bottom 0.152: v22.67,16.69 23.05,16.31 23.05,14.91 23.61,14.35 24.73,14.35 27.21,11.87 27.21,11.58 27.55,11.25 27.55,10.11 H2.4 | v6.72,13.67 6.72,14 9.39,16.67 v9.39,18.42 | v10.07,20.76 10.3,20.98 12.05,20.98 13.4,22.33 13.4,23.07 14.24,23.91 16.35,23.91 16.75,23.5 16.75,23.27 17.11,22.92 17.64,22.92 18,22.56 v18.05,22.56
R7
  Top 0.152: LED.A R7.2
R8  (via drill 0.35)
  Top 0.152: R8.2 8.46,17.57 v8.29,17.73 | PWD.A 9.39,14.17 8.47,14.17 7.71,14.94 7,14.94 6.21,15.73 v6.21,16.44 6.23,16.44
  Bottom 0.152: v8.29,17.73 8.14,17.73 7.13,16.72 6.49,16.72 v6.21,16.44
VDCIA  (via drill 0.35)
  Top 0.152: U$8.22 12.47,19.82 v12.18,19.82 | v17.87,21.06 19.31,22.5 L1.2 | v12.89,12.8 14.59,14.5 14.59,16.08 U$8.3 | C1.2 7.93,10.2 C2.1 7.28,9.96 | C1.2 7.73,10.99 7.73,12.12 7.86,12.12 7.88,12.14 8.58,12.14 8.83,11.89 8.83,11.79 9.41,11.21 v9.41,11.1 | C3.1 8.77,9.46 8.77,9.58 8.23,10.12 C1.2
  Bottom 0.152: v17.87,21.06 17.57,20.76 13.12,20.76 v12.18,19.82 12.56,19.44 12.56,17.25 11.87,16.57 11.81,16.57 11.64,16.4 11.64,15.07 11.98,14.73 12.05,14.73 | v12.89,12.8 12.74,12.96 12.74,14.05 12.05,14.73 | 12.05,14.73 v12.15,14.73 11.5,14.07 11.5,13.54 11.88,13.16 11.88,11.05 11.65,10.82 9.69,10.82 v9.41,11.1
VDD  (via drill 0.35)
  Top 0.152: U$8.5 15.41,16.08 15.41,15.66 15.66,15.41 v15.66,14.94 15.71,14.89 15.71,13.66 15.33,13.29 14.46,13.29 13.35,12.17 12.66,12.17 12,12.83 11.65,12.83 11.48,13.01 10.96,13.01 v10.81,12.86 | U1.2 21.07,10.61 21.07,11.1 | 10.38,14.16 v10.38,14.33 10.2,14.51 10.2,14.69 9.93,14.96 8.28,14.96 7.69,15.55 v7.28,15.55 | v5.83,10.24 5.07,9.48 C4.1 5.07,8.88 C6.1 | v17.59,10.62 20.59,10.62 21.07,11.1 | 21.07,11.1 21.2,11.23 21.2,11.79 21.35,11.94 21.35,14.23 22.32,15.2 22.32,15.86 22.55,16.08 22.92,16.08 23.99,17.15 23.99,17.76 25.85,19.61 H2.8 | R8.1 8.95,16.57 v8.65,16.87
  Bottom 0.152: v10.81,12.86 10.81,13.08 10.38,13.52 v10.38,14.33 10.36,14.33 8.63,12.6 8.24,12.6 5.88,10.24 v5.83,10.24 | v15.66,14.94 15.33,14.61 14.88,14.61 14.49,14.22 14.49,13.54 14.7,13.34 15.35,13.34 15.37,13.35 16.01,12.71 16.01,12.6 17.05,11.56 17.05,11.16 v17.59,10.62 | v7.28,15.55 7.33,15.55 v8.65,16.87
VSW  (via drill 0.35)
  Top 0.152: U$8.4 15.01,16.08 15.01,14.04 v15.1,13.95 | v20.49,22.58 v20.49,22.59 L1.1
  Bottom 0.152: v15.1,13.95 15.36,14.21 16.29,14.21 16.5,14.41 16.5,15.75 18.07,17.32 18.07,17.55 17.77,17.86 17.77,18.4 18.79,19.41 19.32,19.41 19.85,19.95 19.85,20.5 20.49,21.13 v20.49,22.58
X32MI
  Top 0.152: 14.62,20.1 U$8.19 14.6,20.9 14.36,21.14 13.77,21.14 13.64,21.28 13.64,22.48 14.32,23.16 Y1.1
X32MO
  Top 0.152: U$8.18 15,21.27 15.01,21.28 15.01,21.73 15.16,21.88 Y1.3

### Text on the board
tNames: V0.1 | 9 | Brain | GND | 8 | 3V3 | 7 | 16 | 15 | 6 | 5 | 14 | 13 | 4 | 3 | 12 | 2 | 11 | 1 | 10
bNames: Low-Cost Educational Toys, LLC | PA4 | Cambridge, MA, USA | GND | PA5 | VDD | PA10 | PB14 | PA11 | PB15 | www.lce.toys | PA15 | PB22 | PA14 | Desing by: | PB23 | PA13 | PA9 | claudioolmedo.com | PB4 | PA12 | PA8 | Rev. 1 Nov/22 | Model: R53 V0.1 | PB7